# Altium schematic sheet PowerSupply.SchDoc
size A4; SheetNumber: 5; SheetTotal: 5
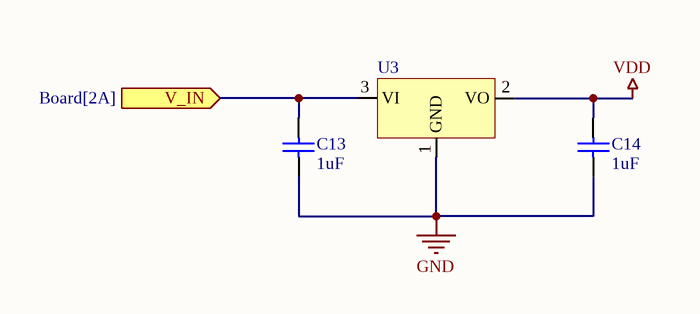
[diagram p0: PowerSupply.SchDoc]

## Parts
C13  1uF  [CAP_0402]
C14  1uF  [CAP_0402]
U3  LDO-Voltage-Regulator-3Pin  [SOT95P237X112-3N]  (value not drawn)

## Ports
V_IN (in, see Board[2A])

## Nets
GND: C13.1 C14.1 U3.1(GND)
VDD: C14.2 U3.2(VO)
V_IN: C13.2 U3.3(VI) ; port V_IN

## Library data of the parts
C13 C14 = Capacitor: Manufacturer: Murata; Part Number: GRM155R71E103KA01D